# Altium schematic sheet OverDrive.SchDoc
size C
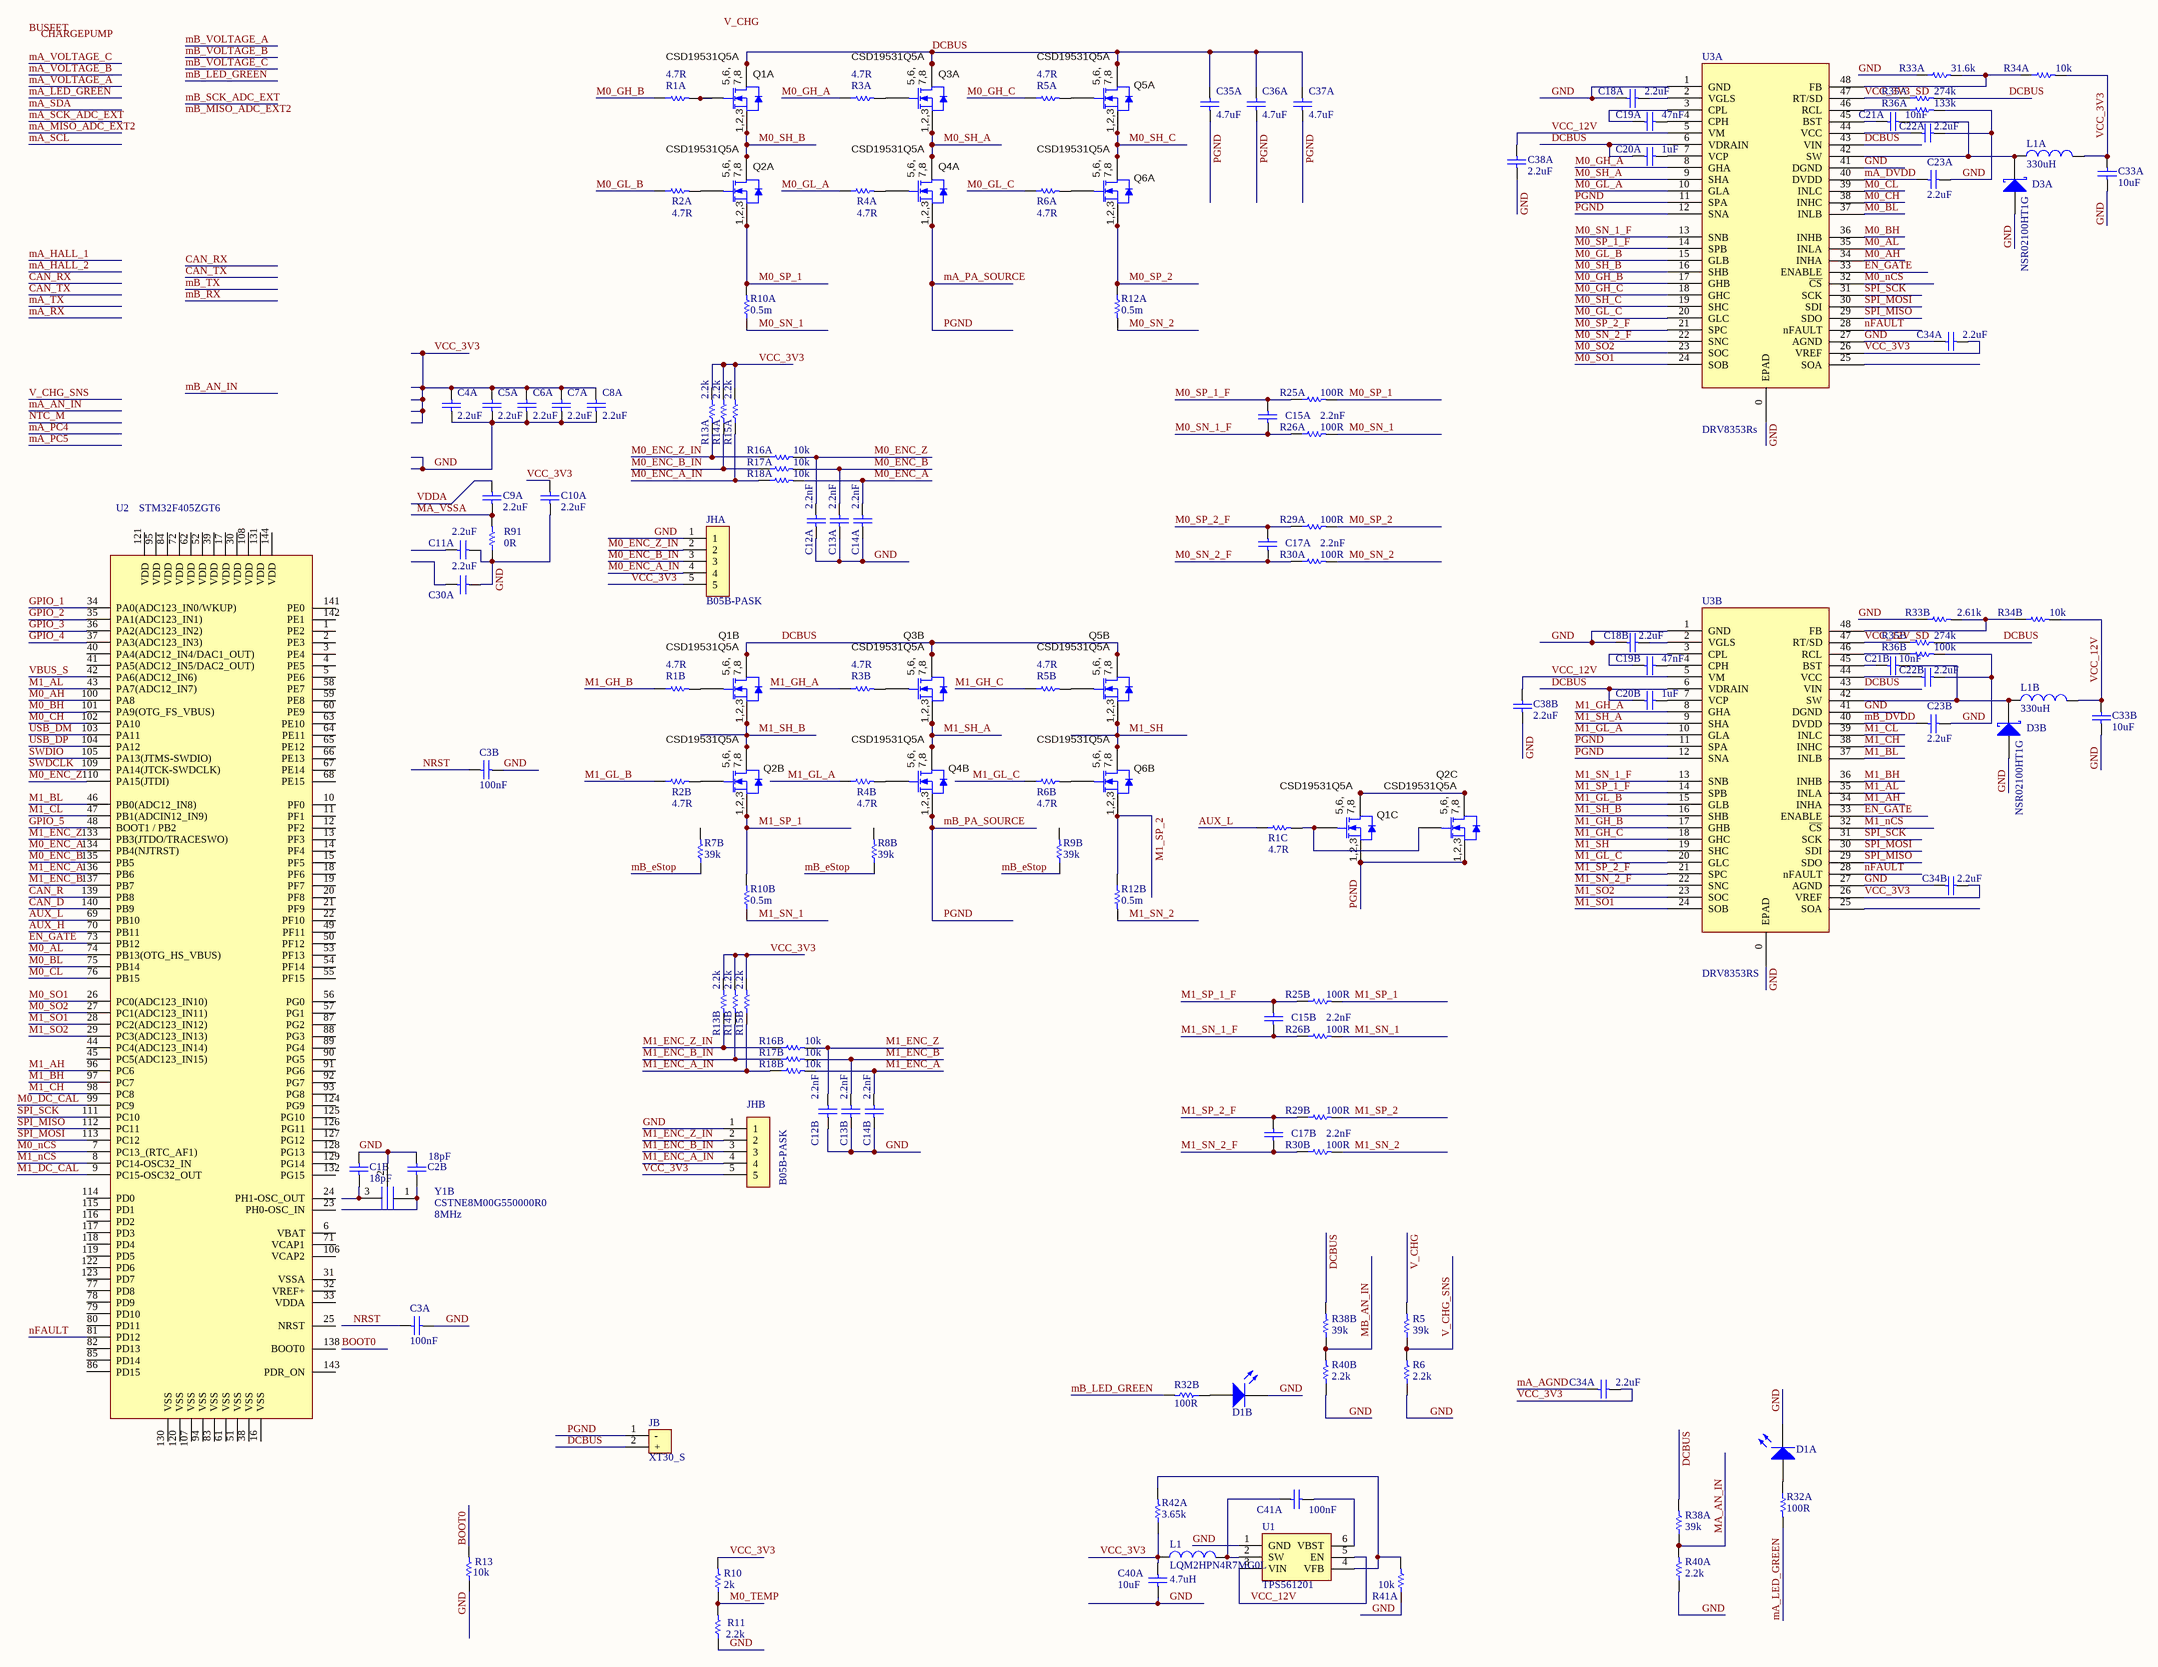
[diagram p0: OverDrive.SchDoc]

## Parts
(Parts that share a designator on the sheet are numbered #1, #2 ... from top to bottom, then left to right.)
C1B  value 18pF  [CAP 0402]  (hidden comment: GCM1555C1H180JA16D)
C2B  value 18pF  [CAP 0402]  (hidden comment: GCM1555C1H180JA16D)
C3A  value 100nF  [CAP 0402]  (hidden comment: C0402C104K3RACTU)
C3B  value 100nF  [CAP 0402]  (hidden comment: C0402C104K3RACTU)
C4A  value 2.2uF  [CAP 0402]  (hidden comment: GRM155C81C225ME15D)
C5A  value 2.2uF  [CAP 0402]  (hidden comment: GRM155C81C225ME15D)
C6A  value 2.2uF  [CAP 0402]  (hidden comment: GRM155C81C225ME15D)
C7A  value 2.2uF  [CAP 0402]  (hidden comment: GRM155C81C225ME15D)
C8A  value 2.2uF  [CAP 0402]  (hidden comment: GRM155C81C225ME15D)
C9A  value 2.2uF  [CAP 0402]  (hidden comment: GRM155C81C225ME15D)
C10A  value 2.2uF  [CAP 0402]  (hidden comment: GRM155C81C225ME15D)
C11A  value 2.2uF  [CAP 0402]  (hidden comment: GRM155C81C225ME15D)
C12A  value 2.2nF  [CAP 0402]  (hidden comment: GCM155R72A222KA37D)
C12B  value 2.2nF  [CAP 0402]  (hidden comment: GCM155R72A222KA37D)
C13A  value 2.2nF  [CAP 0402]  (hidden comment: GCM155R72A222KA37D)
C13B  value 2.2nF  [CAP 0402]  (hidden comment: GCM155R72A222KA37D)
C14A  value 2.2nF  [CAP 0402]  (hidden comment: GCM155R72A222KA37D)
C14B  value 2.2nF  [CAP 0402]  (hidden comment: GCM155R72A222KA37D)
C15A  value 2.2nF  [CAP 0402]  (hidden comment: GCM155R72A222KA37D)
C15B  value 2.2nF  [CAP 0402]  (hidden comment: GCM155R72A222KA37D)
C17A  value 2.2nF  [CAP 0402]  (hidden comment: GCM155R72A222KA37D)
C17B  value 2.2nF  [CAP 0402]  (hidden comment: GCM155R72A222KA37D)
C18A  value 2.2uF  [CAP 0402]  (hidden comment: GRM155C81C225ME15D)
C18B  value 2.2uF  [CAP 0402]  (hidden comment: GRM155C81C225ME15D)
C19A  value 47nF  [CAP 0603]  (hidden comment: C0603C473K1RECAUTO)
C19B  value 47nF  [CAP 0603]  (hidden comment: C0603C473K1RECAUTO)
C20A  value 1uF  [CAP 1206]  (hidden comment: GRJ31CR72A105KE11L)
C20B  value 1uF  [CAP 1206]  (hidden comment: GRJ31CR72A105KE11L)
C21A  value 10nF  [CAP 0402]  (hidden comment: GCM155R71E103JA37D)
C21B  value 10nF  [CAP 0402]  (hidden comment: GCM155R71E103JA37D)
C22A  value 2.2uF  [CAP 0402]  (hidden comment: GRM155C81C225ME15D)
C22B  value 2.2uF  [CAP 0402]  (hidden comment: GRM155C81C225ME15D)
C23A  value 2.2uF  [CAP 0402]  (hidden comment: GRM155C81C225ME15D)
C23B  value 2.2uF  [CAP 0402]  (hidden comment: GRM155C81C225ME15D)
C30A  value 2.2uF  [CAP 0402]  (hidden comment: GRM155C81C225ME15D)
C33A  value 10uF  [CAP 1206]  (hidden comment: TMK316AB7106KL-T)
C33B  value 10uF  [CAP 1206]  (hidden comment: TMK316AB7106KL-T)
C34A#1  value 2.2uF  [CAP 0402]  (hidden comment: GRM155C81C225ME15D)
C34A#2  value 2.2uF  [CAP 0402]  (hidden comment: GRM155C81C225ME15D)
C34B  value 2.2uF  [CAP 0402]  (hidden comment: GRM155C81C225ME15D)
C35A  value 4.7uF  [CAP 1210]  (hidden comment: CGA6M3X7S2A475M200AB)
C36A  value 4.7uF  [CAP 1210]  (hidden comment: CGA6M3X7S2A475M200AB)
C37A  value 4.7uF  [CAP 1210]  (hidden comment: CGA6M3X7S2A475M200AB)
C38A  value 2.2uF  [CAP 0402]  (hidden comment: GRM155C81C225ME15D)
C38B  value 2.2uF  [CAP 0402]  (hidden comment: GRM155C81C225ME15D)
C40A  value 10uF  [CAP 1206]  (hidden comment: TMK316AB7106KL-T)
C41A  value 100nF  [CAP 0402]  (hidden comment: C0402C104K3RACTU)
D1A  LTST-C190KRKT  [LED 0603]  (value not drawn)
D1B  LTST-C190KRKT  [LED 0603]  (value not drawn)
D3A  NSR02100HT1G  [SOD-323/SC76]
D3B  NSR02100HT1G  [SOD-323/SC76]
JB  XT30_S  [XT30 SOCKET]
JHA  B05B-PASK  [B05B-PASK]
JHB  B05B-PASK  [B05B-PASK]
L1  LQM2HPN4R7MG0L  value 4.7uH  [IND 1008]
L1A  value 330uH  [SDE0805A]  (hidden comment: SDE0805A-331K)
L1B  value 330uH  [SDE0805A]  (hidden comment: SDE0805A-331K)
Q1A  CSD19531Q5A  [VSONP-8]
Q1B  CSD19531Q5A  [VSONP-8]
Q1C  CSD19531Q5A  [VSONP-8]
Q2A  CSD19531Q5A  [VSONP-8]
Q2B  CSD19531Q5A  [VSONP-8]
Q2C  CSD19531Q5A  [VSONP-8]
Q3A  CSD19531Q5A  [VSONP-8]
Q3B  CSD19531Q5A  [VSONP-8]
Q4A  CSD19531Q5A  [VSONP-8]
Q4B  CSD19531Q5A  [VSONP-8]
Q5A  CSD19531Q5A  [VSONP-8]
Q5B  CSD19531Q5A  [VSONP-8]
Q6A  CSD19531Q5A  [VSONP-8]
Q6B  CSD19531Q5A  [VSONP-8]
R1A  value 4.7R  [RES 0402]  (hidden comment: ERJ-PA3J4R7V)
R1B  value 4.7R  [RES 0402]  (hidden comment: ERJ-PA3J4R7V)
R1C  value 4.7R  [RES 0402]  (hidden comment: ERJ-PA3J4R7V)
R2A  value 4.7R  [RES 0402]  (hidden comment: ERJ-PA3J4R7V)
R2B  value 4.7R  [RES 0402]  (hidden comment: ERJ-PA3J4R7V)
R3A  value 4.7R  [RES 0402]  (hidden comment: ERJ-PA3J4R7V)
R3B  value 4.7R  [RES 0402]  (hidden comment: ERJ-PA3J4R7V)
R4A  value 4.7R  [RES 0402]  (hidden comment: ERJ-PA3J4R7V)
R4B  value 4.7R  [RES 0402]  (hidden comment: ERJ-PA3J4R7V)
R5  value 39k  [RES 0402]  (hidden comment: ERJ-2RKF3902X)
R5A  value 4.7R  [RES 0402]  (hidden comment: ERJ-PA3J4R7V)
R5B  value 4.7R  [RES 0402]  (hidden comment: ERJ-PA3J4R7V)
R6  value 2.2k  [RES 0402]  (hidden comment: ERJ-2RKF2201X)
R6A  value 4.7R  [RES 0402]  (hidden comment: ERJ-PA3J4R7V)
R6B  value 4.7R  [RES 0402]  (hidden comment: ERJ-PA3J4R7V)
R7B  value 39k  [RES 0402]  (hidden comment: ERJ-2RKF3902X)
R8B  value 39k  [RES 0402]  (hidden comment: ERJ-2RKF3902X)
R9B  value 39k  [RES 0402]  (hidden comment: ERJ-2RKF3902X)
R10  value 2k  [RES 0402]  (hidden comment: ERT-J0EG202GM)
R10A  0.5m  [RES 2512]
R10B  0.5m  [RES 2512]
R11  value 2.2k  [RES 0402]  (hidden comment: ERJ-2RKF2201X)
R12A  0.5m  [RES 2512]
R12B  0.5m  [RES 2512]
R13  value 10k  [RES 0402]  (hidden comment: ERJ-2RKF1002X)
R13A  value 2.2k  [RES 0402]  (hidden comment: ERJ-2RKF2201X)
R13B  value 2.2k  [RES 0402]  (hidden comment: ERJ-2RKF2201X)
R14A  value 2.2k  [RES 0402]  (hidden comment: ERJ-2RKF2201X)
R14B  value 2.2k  [RES 0402]  (hidden comment: ERJ-2RKF2201X)
R15A  value 2.2k  [RES 0402]  (hidden comment: ERJ-2RKF2201X)
R15B  value 2.2k  [RES 0402]  (hidden comment: ERJ-2RKF2201X)
R16A  value 10k  [RES 0402]  (hidden comment: ERJ-2RKF1002X)
R16B  value 10k  [RES 0402]  (hidden comment: ERJ-2RKF1002X)
R17A  value 10k  [RES 0402]  (hidden comment: ERJ-2RKF1002X)
R17B  value 10k  [RES 0402]  (hidden comment: ERJ-2RKF1002X)
R18A  value 10k  [RES 0402]  (hidden comment: ERJ-2RKF1002X)
R18B  value 10k  [RES 0402]  (hidden comment: ERJ-2RKF1002X)
R25A  value 100R  [RES 0402]  (hidden comment: ERJ-2RKF1000X)
R25B  value 100R  [RES 0402]  (hidden comment: ERJ-2RKF1000X)
R26A  value 100R  [RES 0402]  (hidden comment: ERJ-2RKF1000X)
R26B  value 100R  [RES 0402]  (hidden comment: ERJ-2RKF1000X)
R29A  value 100R  [RES 0402]  (hidden comment: ERJ-2RKF1000X)
R29B  value 100R  [RES 0402]  (hidden comment: ERJ-2RKF1000X)
R30A  value 100R  [RES 0402]  (hidden comment: ERJ-2RKF1000X)
R30B  value 100R  [RES 0402]  (hidden comment: ERJ-2RKF1000X)
R32A  value 100R  [RES 0402]  (hidden comment: ERJ-2RKF1000X)
R32B  value 100R  [RES 0402]  (hidden comment: ERJ-2RKF1000X)
R33A  value 31.6k  [RES 0402]  (hidden comment: ERJ-2RKF3162X)
R33B  value 2.61k  [RES 0402]  (hidden comment: ERJ-2RKF2611X)
R34A  value 10k  [RES 0402]  (hidden comment: ERJ-2RKF1002X)
R34B  value 10k  [RES 0402]  (hidden comment: ERJ-2RKF1002X)
R35A  value 274k  [RES 0402]  (hidden comment: ERJ-2RKF2743X)
R35B  value 274k  [RES 0402]  (hidden comment: ERJ-2RKF2743X)
R36A  value 133k  [RES 0402]  (hidden comment: ERJ-2RKF1333X)
R36B  value 100k  [RES 0402]  (hidden comment: ERJ-2RKF1003X)
R38A  value 39k  [RES 0402]  (hidden comment: ERJ-2RKF3902X)
R38B  value 39k  [RES 0402]  (hidden comment: ERJ-2RKF3902X)
R40A  value 2.2k  [RES 0402]  (hidden comment: ERJ-2RKF2201X)
R40B  value 2.2k  [RES 0402]  (hidden comment: ERJ-2RKF2201X)
R41A  value 10k  [RES 0402]  (hidden comment: ERJ-2RKF1002X)
R42A  value 3.65k  [RES 0402]  (hidden comment: ERJ-2RKF3651X)
R91  value 0R  [RES 0402]  (hidden comment: ERJ-2GE0R00X)
U1  TPS561201  [SOT-23-6]
U2  STM32F405ZGT6  [QFP-144 - P0.5MM]
U3A  DRV8353Rs  [QFN-48 - P0.5MM]
U3B  DRV8353RS  [QFN-48 - P0.5MM]
Y1B  CSTNE8M00G550000R0  value 8MHz  [MuRata CSTN]

## Nets
AUX_H: U2.70(PB11)
AUX_L: R1C.1 U2.69(PB10)
BOOT0: R13.2
CAN_D: U2.140(PB9)
CAN_R: U2.139(PB8)
DCBUS: C20A.1 C20B.1 C35A.2 C36A.2 C37A.2 JB.2(+) Q1A.5(D) Q1A.6(D) Q1A.7(D) Q1A.8(D) Q1A.9(D) Q1B.5(D) Q1B.6(D) Q1B.7(D) Q1B.8(D) Q1B.9(D) Q3A.5(D) Q3A.6(D) Q3A.7(D) Q3A.8(D) Q3A.9(D) Q3B.5(D) Q3B.6(D) Q3B.7(D) Q3B.8(D) Q3B.9(D) Q5A.5(D) Q5A.6(D) Q5A.7(D) Q5A.8(D) Q5A.9(D) Q5B.5(D) Q5B.6(D) Q5B.7(D) Q5B.8(D) Q5B.9(D) R35A.2 R35B.2 R38A.2 R38B.2 U3A.6(VDRAIN) U3A.43(VIN) U3B.6(VDRAIN) U3B.43(VIN)
EN_GATE: U2.73(PB12) U3A.33(ENABLE) U3B.33(ENABLE)
GND: C1B.2 C2B.2 C3A.2 C3B.2 C4A.2 C5A.2 C6A.2 C7A.2 C8A.2 C10A.2 C11A.2 C12A.1 C12B.1 C13A.1 C13B.1 C14A.1 C14B.1 C18A.2 C18B.2 C22A.1 C22B.1 C23A.1 C23B.1 C30A.2 C33A.2 C33B.2 C34A#1.2 C34B.2 C38A.2 C38B.2 C40A.2 D1A.2(K) D1B.2(K) D3A.1(A) D3B.1(A) JHA.1 JHB.1 R6.1 R11.1 R13.1 R33A.1 R33B.1 R36A.2 R36B.2 R40A.1 R40B.1 R41A.1 R91.1 U1.1(GND) U3A.0(EPAD) U3A.1(GND) U3A.27(AGND) U3A.41(DGND) U3B.0(EPAD) U3B.1(GND) U3B.27(AGND) U3B.41(DGND) Y1B.2
GPIO_1: U2.34(PA0(ADC123_IN0/WKUP))
GPIO_2: U2.35(PA1(ADC123_IN1))
GPIO_3: U2.36(PA2(ADC123_IN2))
GPIO_4: U2.37(PA3(ADC123_IN3))
GPIO_5: U2.48(BOOT1_/_PB2)
M0_AH: U2.100(PA8) U3A.34(INHA)
M0_AL: U2.74(PB13(OTG_HS_VBUS)) U3A.35(INLA)
M0_BH: U2.101(PA9(OTG_FS_VBUS)) U3A.36(INHB)
M0_BL: U2.75(PB14) U3A.37(INLB)
M0_CH: U2.102(PA10) U3A.38(INHC)
M0_CL: U2.76(PB15) U3A.39(INLC)
M0_DC_CAL: U2.99(PC9)
M0_ENC_A: C14A.2 R18A.2 U2.134(PB4(NJTRST))
M0_ENC_A_IN: JHA.4 R15A.1 R18A.1
M0_ENC_B: C13A.2 R17A.2 U2.135(PB5)
M0_ENC_B_IN: JHA.3 R14A.1 R17A.1
M0_ENC_Z: C12A.2 R16A.2 U2.110(PA15(JTDI))
M0_ENC_Z_IN: JHA.2 R13A.1 R16A.1
M0_GH_A: R3A.1 U3A.8(GHA)
M0_GH_B: R1A.1 U3A.17(GHB)
M0_GH_C: R5A.1 U3A.18(GHC)
M0_GL_A: R4A.1 U3A.10(GLA)
M0_GL_B: R2A.1 U3A.15(GLB)
M0_GL_C: R6A.1 U3A.20(GLC)
M0_nCS: U2.7(PC13_(RTC_AF1)) U3A.32(~{CS})
M0_SH_A: Q3A.1(S) Q3A.2(S) Q3A.3(S) Q4A.5(D) Q4A.6(D) Q4A.7(D) Q4A.8(D) Q4A.9(D) U3A.9(SHA)
M0_SH_B: Q1A.1(S) Q1A.2(S) Q1A.3(S) Q2A.5(D) Q2A.6(D) Q2A.7(D) Q2A.8(D) Q2A.9(D) U3A.16(SHB)
M0_SH_C: Q5A.1(S) Q5A.2(S) Q5A.3(S) Q6A.5(D) Q6A.6(D) Q6A.7(D) Q6A.8(D) Q6A.9(D) U3A.19(SHC)
M0_SN_1: R10A.1 R26A.2
M0_SN_1_F: C15A.1 R26A.1 U3A.13(SNB)
M0_SN_2: R12A.2 R30A.2
M0_SN_2_F: C17A.1 R30A.1 U3A.22(SNC)
M0_SO1: U2.26(PC0(ADC123_IN10)) U3A.24(SOB)
M0_SO2: U2.27(PC1(ADC123_IN11)) U3A.23(SOC)
M0_SP_1: Q2A.1(S) Q2A.2(S) Q2A.3(S) R10A.2 R25A.2
M0_SP_1_F: C15A.2 R25A.1 U3A.14(SPB)
M0_SP_2: Q6A.1(S) Q6A.2(S) Q6A.3(S) R12A.1 R29A.2
M0_SP_2_F: C17A.2 R29A.1 U3A.21(SPC)
M0_TEMP: R10.1 R11.2
M1_AH: U2.96(PC6) U3B.34(INHA)
M1_AL: U2.43(PA7(ADC12_IN7)) U3B.35(INLA)
M1_BH: U2.97(PC7) U3B.36(INHB)
M1_BL: U2.46(PB0(ADC12_IN8)) U3B.37(INLB)
M1_CH: U2.98(PC8) U3B.38(INHC)
M1_CL: U2.47(PB1(ADCIN12_IN9)) U3B.39(INLC)
M1_DC_CAL: U2.9(PC15-OSC32_OUT)
M1_ENC_A: C14B.2 R18B.2 U2.136(PB6)
M1_ENC_A_IN: JHB.4 R15B.1 R18B.1
M1_ENC_B: C13B.2 R17B.2 U2.137(PB7)
M1_ENC_B_IN: JHB.3 R14B.1 R17B.1
M1_ENC_Z: C12B.2 R16B.2 U2.133(PB3(JTDO/TRACESWO))
M1_ENC_Z_IN: JHB.2 R13B.1 R16B.1
M1_GH_A: R3B.1 U3B.8(GHA)
M1_GH_B: R1B.1 U3B.17(GHB)
M1_GH_C: R5B.1 U3B.18(GHC)
M1_GL_A: R4B.1 U3B.10(GLA)
M1_GL_B: R2B.1 U3B.15(GLB)
M1_GL_C: R6B.1 U3B.20(GLC)
M1_nCS: U2.8(PC14-OSC32_IN) U3B.32(~{CS})
M1_SH: Q5B.1(S) Q5B.2(S) Q5B.3(S) Q6B.5(D) Q6B.6(D) Q6B.7(D) Q6B.8(D) Q6B.9(D) U3B.19(SHC)
M1_SH_A: Q3B.1(S) Q3B.2(S) Q3B.3(S) Q4B.5(D) Q4B.6(D) Q4B.7(D) Q4B.8(D) Q4B.9(D) U3B.9(SHA)
M1_SH_B: Q1B.1(S) Q1B.2(S) Q1B.3(S) Q2B.5(D) Q2B.6(D) Q2B.7(D) Q2B.8(D) Q2B.9(D) U3B.16(SHB)
M1_SN_1: R10B.1 R26B.2
M1_SN_1_F: C15B.1 R26B.1 U3B.13(SNB)
M1_SN_2: R12B.2 R30B.2
M1_SN_2_F: C17B.1 R30B.1 U3B.22(SNC)
M1_SO1: U2.28(PC2(ADC123_IN12)) U3B.24(SOB)
M1_SO2: U2.29(PC3(ADC123_IN13)) U3B.23(SOC)
M1_SP_1: Q2B.1(S) Q2B.2(S) Q2B.3(S) R10B.2 R25B.2
M1_SP_1_F: C15B.2 R25B.1 U3B.14(SPB)
M1_SP_2: Q6B.1(S) Q6B.2(S) Q6B.3(S) R12B.1 R29B.2
M1_SP_2_F: C17B.2 R29B.1 U3B.21(SPC)
mA_AGND: C34A#2.2
mA_AN_IN: R38A.1 R40A.2
mA_DVDD: C23A.2 U3A.40(DVDD)
mA_LED_GREEN: R32A.2
mA_PA_SOURCE: C35A.1 C36A.1 C37A.1 JB.1(-) Q1C.1(S) Q1C.2(S) Q1C.3(S) Q2C.1(S) Q2C.2(S) Q2C.3(S) Q4A.1(S) Q4A.2(S) Q4A.3(S) Q4B.1(S) Q4B.2(S) Q4B.3(S) U3A.11(SPA) U3A.12(SNA) U3B.11(SPA) U3B.12(SNA)  [also labelled mB_PA_SOURCE, PGND]
MA_VSSA: C9A.2 R91.2
mB_AN_IN: R38B.1 R40B.2
mB_DVDD: C23B.2 U3B.40(DVDD)
mB_eStop: R7B.1 R8B.1 R9B.1
mB_LED_GREEN: R32B.2
nFAULT: U2.81(PD12) U3A.28(nFAULT) U3B.28(nFAULT)
NRST: C3A.1 C3B.1
SPI_MISO: U2.112(PC11) U3A.29(SDO) U3B.29(SDO)
SPI_MOSI: U2.113(PC12) U3A.30(SDI) U3B.30(SDI)
SPI_SCK: U2.111(PC10) U3A.31(SCK) U3B.31(SCK)
SWDCLK: U2.109(PA14(JTCK-SWDCLK))
SWDIO: U2.105(PA13(JTMS-SWDIO))
USB_DM: U2.103(PA11)
USB_DP: U2.104(PA12)
V_CHG: R5.2
V_CHG_SNS: R5.1 R6.2
VBUS_S: U2.42(PA6(ADC12_IN6))
VCC_3V3: C4A.1 C5A.1 C6A.1 C7A.1 C8A.1 C10A.1 C33A.1 C34A#1.1 C34A#2.1 C34B.1 C40A.1 JHA.5 JHB.5 L1.1 L1A.2 R10.2 R13A.2 R13B.2 R14A.2 R14B.2 R15A.2 R15B.2 R34A.2 R42A.1 U3A.26(VREF) U3B.26(VREF)
VCC_3V3_SD: R35A.1 U3A.47(RT/SD)
VCC_12V: C33B.1 C38A.1 C38B.1 L1B.2 R34B.2 U1.3(VIN) U1.5(EN) U3A.5(VM) U3B.5(VM)
VCC_12V_SD: R35B.1 U3B.47(RT/SD)
VDDA: C9A.1
NetC1B_1: C1B.1 Y1B.3
NetC2B_1: C2B.1 Y1B.1
NetC18A_1: C18A.1 U3A.2(VGLS)
NetC18B_1: C18B.1 U3B.2(VGLS)
NetC19A_1: C19A.1 U3A.3(CPL)
NetC19A_2: C19A.2 U3A.4(CPH)
NetC19B_1: C19B.1 U3B.3(CPL)
NetC19B_2: C19B.2 U3B.4(CPH)
NetC20A_2: C20A.2 U3A.7(VCP)
NetC20B_2: C20B.2 U3B.7(VCP)
NetC21A_1: C21A.1 U3A.45(BST)
NetC21A_2: C21A.2 D3A.2(K) L1A.1 U3A.42(SW)
NetC21B_1: C21B.1 U3B.45(BST)
NetC21B_2: C21B.2 D3B.2(K) L1B.1 U3B.42(SW)
NetC22A_2: C22A.2 U3A.44(VCC)
NetC22B_2: C22B.2 U3B.44(VCC)
NetC41A_1: C41A.1 L1.2 U1.2(SW)
NetC41A_2: C41A.2 U1.6(VBST)
NetD1A_1: D1A.1(A) R32A.1
NetD1B_1: D1B.1(A) R32B.1
NetQ1A_4: Q1A.4(G) R1A.2
NetQ1B_4: Q1B.4(G) R1B.2
NetQ1C_4: Q1C.4(G) Q2C.4(G) R1C.2
NetQ1C_5: Q1C.5(D) Q1C.6(D) Q1C.7(D) Q1C.8(D) Q1C.9(D) Q2C.5(D) Q2C.6(D) Q2C.7(D) Q2C.8(D) Q2C.9(D)
NetQ2A_4: Q2A.4(G) R2A.2
NetQ2B_4: Q2B.4(G) R2B.2
NetQ3A_4: Q3A.4(G) R3A.2
NetQ3B_4: Q3B.4(G) R3B.2
NetQ4A_4: Q4A.4(G) R4A.2
NetQ4B_4: Q4B.4(G) R4B.2
NetQ5A_4: Q5A.4(G) R5A.2
NetQ5B_4: Q5B.4(G) R5B.2
NetQ6A_4: Q6A.4(G) R6A.2
NetQ6B_4: Q6B.4(G) R6B.2
NetR33A_2: R33A.2 R34A.1 U3A.48(FB)
NetR33B_2: R33B.2 R34B.1 U3B.48(FB)
NetR36A_1: R36A.1 U3A.46(RCL)
NetR36B_1: R36B.1 U3B.46(RCL)
NetR41A_2: R41A.2 R42A.2 U1.4(VFB)

Not connected (* = marked no-connect by the designer): C11A 1; C30A 1; R7B 2; R8B 2; R9B 2; U2 1(PE2) 2(PE3) 3(PE4) 4(PE5) 5(PE6) 6(VBAT) 10(PF0) 11(PF1) 12(PF2) 13(PF3) 14(PF4) 15(PF5) 16(VSS) 17(VDD) 18(PF6) 19(PF7) 20(PF8) 21(PF9) 22(PF10) 23(PH0-OSC_IN) 24(PH1-OSC_OUT) 25(NRST) 30(VDD) 31(VSSA) 32(VREF+) 33(VDDA) 38(VSS) 39(VDD) 40(PA4(ADC12_IN4/DAC1_OUT)) 41(PA5(ADC12_IN5/DAC2_OUT)) 44(PC4(ADC123_IN14)) 45(PC5(ADC123_IN15)) 49(PF11) 50(PF12) 51(VSS) 52(VDD) 53(PF13) 54(PF14) 55(PF15) 56(PG0) 57(PG1) 58(PE7) 59(PE8) 60(PE9) 61(VSS) 62(VDD) 63(PE10) 64(PE11) 65(PE12) 66(PE13) 67(PE14) 68(PE15) 71(VCAP1) 72(VDD) 77(PD8) 78(PD9) 79(PD10) 80(PD11) 82(PD13) 83(VSS) 84(VDD) 85(PD14) 86(PD15) 87(PG2) 88(PG3) 89(PG4) 90(PG5) 91(PG6) 92(PG7) 93(PG8) 94(VSS) 95(VDD) 106(VCAP2) 107(VSS) 108(VDD) 114(PD0) 115(PD1) 116(PD2) 117(PD3) 118(PD4) 119(PD5) 120(VSS) 121(VDD) 122(PD6) 123(PD7) 124(PG9) 125(PG10) 126(PG11) 127(PG12) 128(PG13) 129(PG14) 130(VSS) 131(VDD) 132(PG15) 138(BOOT0) 141(PE0) 142(PE1) 143(PDR_ON) 144(VDD); U3A 25(SOA); U3B 25(SOA)

## Notes on the sheet
- Labels drawn without touching a wire or pin: BUSFET, CHARGEPUMP, mB_MISO_ADC_EXT2, V_CHG
- (in symbol CSD19531Q5A) 5,6,; 7,8; 1,2,3

## Library data of the parts
C1B C2B = GCM1555C1H180JA16D: CAP 0402 18pF 50V (NP0 Dielectric); WVDC: 50
C3A C3B C41A = C0402C104K3RACTU: CAP 0402 100nF 10V; WVDC: 25
C4A C5A C6A C7A C8A C9A C10A C11A C18A C18B C22A C22B C23A C23B C30A C34A#1 C34A#2 C34B C38A C38B = GRM155C81C225ME15D: CAP 0402 2.2uF 16V; WVDC: 16
C12A C12B C13A C13B C14A C14B C15A C15B C17A C17B = GCM155R72A222KA37D: CAP 0402 2.2nF 100V (X7R DIELECTRIC); WVDC: 100
C19A C19B = C0603C473K1RECAUTO: CAP 0603 47nF 100V (X7R DIELECTRIC); WVDC: 100
C20A C20B = GRJ31CR72A105KE11L: CAP 1206 1uF 100V; WVDC: 100
C21A C21B = GCM155R71E103JA37D: CAP 0402 10nF 25V; WVDC: 25
C33A C33B C40A = TMK316AB7106KL-T: CAP 1206 10uF 25V; WVDC: 25
C35A C36A C37A = CGA6M3X7S2A475M200AB: CAP 1206 4.7uF 100V; WVDC: 100
D1A D1B = LTST-C190KRKT: RED LED
D3A D3B = NSR02100HT1G: Schottky Diodes & Rectifiers 100V; Vrrm: 100; If: 200mA
JB = XT30_S: XT30 SOCKET
L1 = LQM2HPN4R7MG0L: Fixed Inductors 1008 4.7uH 20% 1.1A
L1A L1B = SDE0805A-331K: Fixed Inductors 330uH 10% SMD 0805 AEC-Q200; Isat: 400mA
Q1A Q1B Q1C Q2A Q2B Q2C Q3A Q3B Q4A Q4B Q5A Q5B Q6A Q6B = CSD19531Q5A: 100V 100A VSONP-8 5.3mOhm Pwr MOSFET; Manufacturer: Texas Instruments; Value2: 48 nC; QgTyp_nC: 48; SizeAreaWB_mm2: 56; SizeArea_mm2: 30; SizeX_mm: 6; SizeY_mm: 5; SizeZ_mm: 1; PartNumber: CSD19531Q5A; Value: 100V; VdsMax_V: 100V; Vgs_V: 100V; IdsMax_A: 100A; RoHS: Y; ComponentLink1Description: Datasheet link
R1A R1B R1C R2A R2B R3A R3B R4A R4B R5A R5B R6A R6B = ERJ-PA3J4R7V: RES 0402 4.7R 5%
R5 R7B R8B R9B R38A R38B = ERJ-2RKF3902X: RES 0402 39k 1%
R6 R11 R13A R13B R14A R14B R15A R15B R40A R40B = ERJ-2RKF2201X: RES 0402 2.2k 1%
R10 = ERT-J0EG202GM: NTC THERMISTOR 0402 2k 2%
R10A R10B R12A R12B = CSR2512C0R0005F: RES SMD 0.0005 OHM 1% 3W 2512; Manufacturer: Riedon; Temperature Coefficient: ±100ppm/°C; Supplier 1: Digi-Key; Supplier Part Number 1: 696-1183-2-ND; RoHS: RoHS Compliant; Category: Resistors; Stock: 2000; Pricing 1: 2000=0.19817, 6000=0.1937, 10000=0.187, 50000=0.18148 (USD); Packaging: Tape & Reel (TR); Part Status: Active; Tolerance: ±1%; Power (Watts): 3W; Composition: Metal Element; Features: Current Sense; Operating Temperature: -55°C ~ 170°C; Package / Case: 2512 (6432 Metric); Supplier Device Package: 2512; Size / Dimension: 0.250" L x 0.118" W (6.35mm x 3.00mm); Height - Seated (Max): 0.057" (1.45mm); Failure Rate: -; ComponentLink1URL: http://riedon.com/media/pdf/CSR.pdf; ComponentLink1Description: http://riedon.com/media/pdf/CSR.pdf; Supplier 2: Digi-Key; Supplier Part Number 2: 696-1183-1-ND; Pricing 2: 1=0.69, 10=0.574, 25=0.4916, 50=0.4426, 100=0.3852, 250=0.3442, 500=0.27864, 1000=0.22536 (USD); Manufacturer Part Number: CSR2512C0R0005F
R13 R16A R16B R17A R17B R18A R18B R34A R34B R41A = ERJ-2RKF1002X: RES 0402 10k 1%
R25A R25B R26A R26B R29A R29B R30A R30B R32A R32B = ERJ-2RKF1000X: RES 0402 100R 1%
R33A = ERJ-2RKF3162X: RES 0402 31.6k 1%
R33B = ERJ-2RKF2611X: RES 0402 2.61k 1%
R35A R35B = ERJ-2RKF2743X: RES 0402 274k 1%
R36A = ERJ-2RKF1333X: RES 0402 133k 1%
R36B = ERJ-2RKF1003X: RES 0402 100k 1%
R42A = ERJ-2RKF3651X: RES 0402 3.65k 1%
R91 = ERJ-2GE0R00X: RES 0402 0R
U1 = TPS561201: 4.5V to 17V Input, 1A Synchronous Step-Down Voltage Regulator in 6-pin SOT-23
U2 = STM32F405ZGT6: Cortex M4 MCU
U3A U3B = DRV8353RS: 100V Three Phase Gate Driver With 3 Current Shunt Amplifiers and Buck Regulator
Y1B = CSTNE8M00G550000R0: Ceramic Resonator 8.0000MHz 33pf 0.5%